# Altium schematic sheet jtag.SchDoc: JTAG
size A4; Author: GAA; Organization: heig-vd; Address1: heig-vd; Address2: Route de Cheseaux 1; Address3: 1401 Yverdon-les-Bains; Address4: Suisse; DocumentNumber: 6; Revision: 1.1; SheetNumber: 6; SheetTotal: 12; PageSetup: Record=PageOptions|CenterHorizontal=True|CenterVertical=True|PrintScale=1.00|XCorrection=1.00|YCorrection=1.00|PrintKind=1|BorderSize=5000000|LeftOffset=0|BottomOffset=0|Orientation=2|PaperLength=1000|PaperWidth=1000|Scale=100|PaperSource=7|PrintQuality=-3|MediaType=1|DitherType=10|PrintScaleMode=1|PaperKind=A4 (210 x 297 mm)|PaperIndex=9
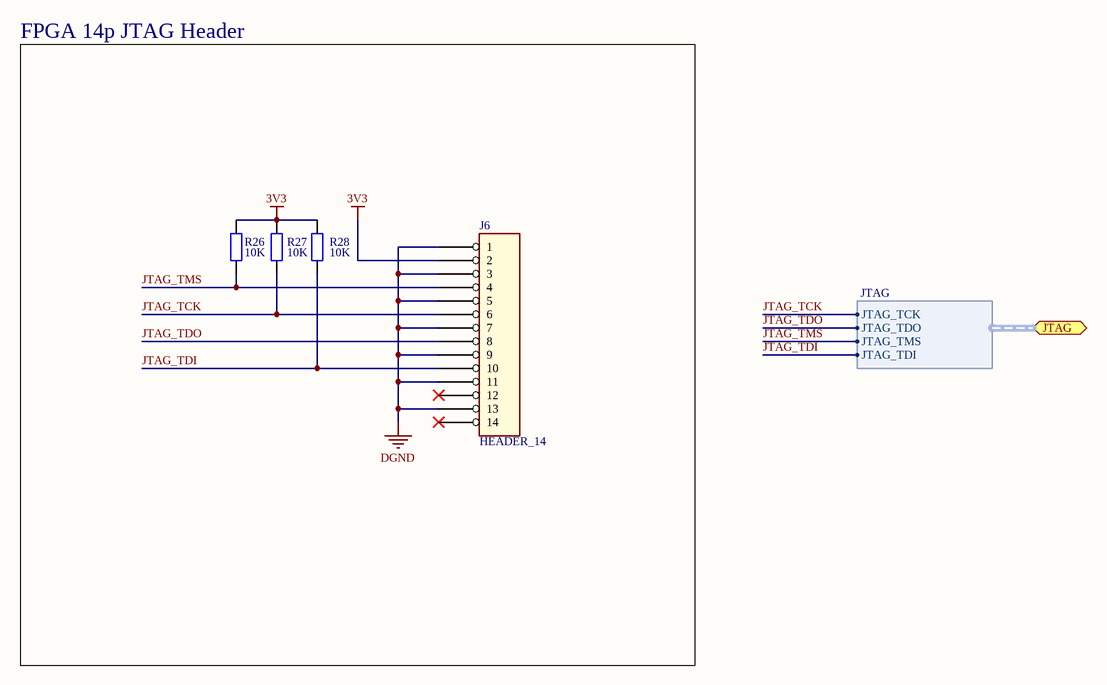
[diagram p0: jtag.SchDoc]

## Parts
J6  HEADER_14  [Male Box Header 2mm 14P]
R26  10K  [SM/R_0603]
R27  10K  [SM/R_0603]
R28  10K  [SM/R_0603]

## Blocks framed on the sheet
FPGA 14p JTAG Header: J6 R26-R28

## Ports
JTAG (harness JTAG)

## Harnesses
JTAG: JTAG_TCK, JTAG_TDI, JTAG_TDO, JTAG_TMS

## Nets
3V3: J6.2 R26.1 R27.1 R28.1
DGND: J6.1 J6.3 J6.5 J6.7 J6.9 J6.11 J6.13
JTAG_TCK: J6.6 R27.2 ; port JTAG.JTAG_TCK
JTAG_TDI: J6.10 R28.2 ; port JTAG.JTAG_TDI
JTAG_TDO: J6.8 ; port JTAG.JTAG_TDO
JTAG_TMS: J6.4 R26.2 ; port JTAG.JTAG_TMS

Not connected (* = marked no-connect by the designer): J6 12* 14*

## Notes on the sheet
- Route de Cheseaux 1
- CH-1401 Yverdon-les-Bains
- Titre:
- Date:
- Projet:
- Revision:
- Sheet
- of
- File:

## Library data of the parts
J6 = 354: Male Box Header 14 poles; Manufacturer: Würth; Manufacturer P/N: 625 014 216 21; ID: 354; Pitch: 2mm; Component Type: Connecteur 2mm; Connector Type: HEADER14; Supplier 1: Würth Elektronik; Supplier Part Number 1: 625 014 216 21; ComponentLink1Description: Datasheet; ComponentLink1URL: http://katalog.we-online.de/em/datasheet/6250xx21621.pdf; ComponentLink2Description: Supplier; ComponentLink2URL: http://katalog.we-online.de/en/em/BHD_2_00_MALE_BOX_HEADER_6250XX21621/62501021621?m=n&sp=http%3A%2F%2Fwww.we-online.de%2Fweb%2Fen%2Felectronic_components%2Fsearchpage_PBS.php%3Fsearch%3D62501021621&_ga=1.208171730.1533585039.1428388574; RoHS Compliant1: True
R26-R28 = 133: Résistance 0603 63mW 1% 10K; Manufacturer: Multicomp; Manufacturer P/N: MC 0.036mW 0603 1% 10K; ID: 133; Voltage: 50V; Value: 10K; Component Type: Résistance; Power: 63mW; Tolerance: 1%; Supplier 1: Farnell; Supplier Part Number 1: 9330399; RoHS Compliant: False